# EAGLE design B198X (EAGLE 6.6.0)
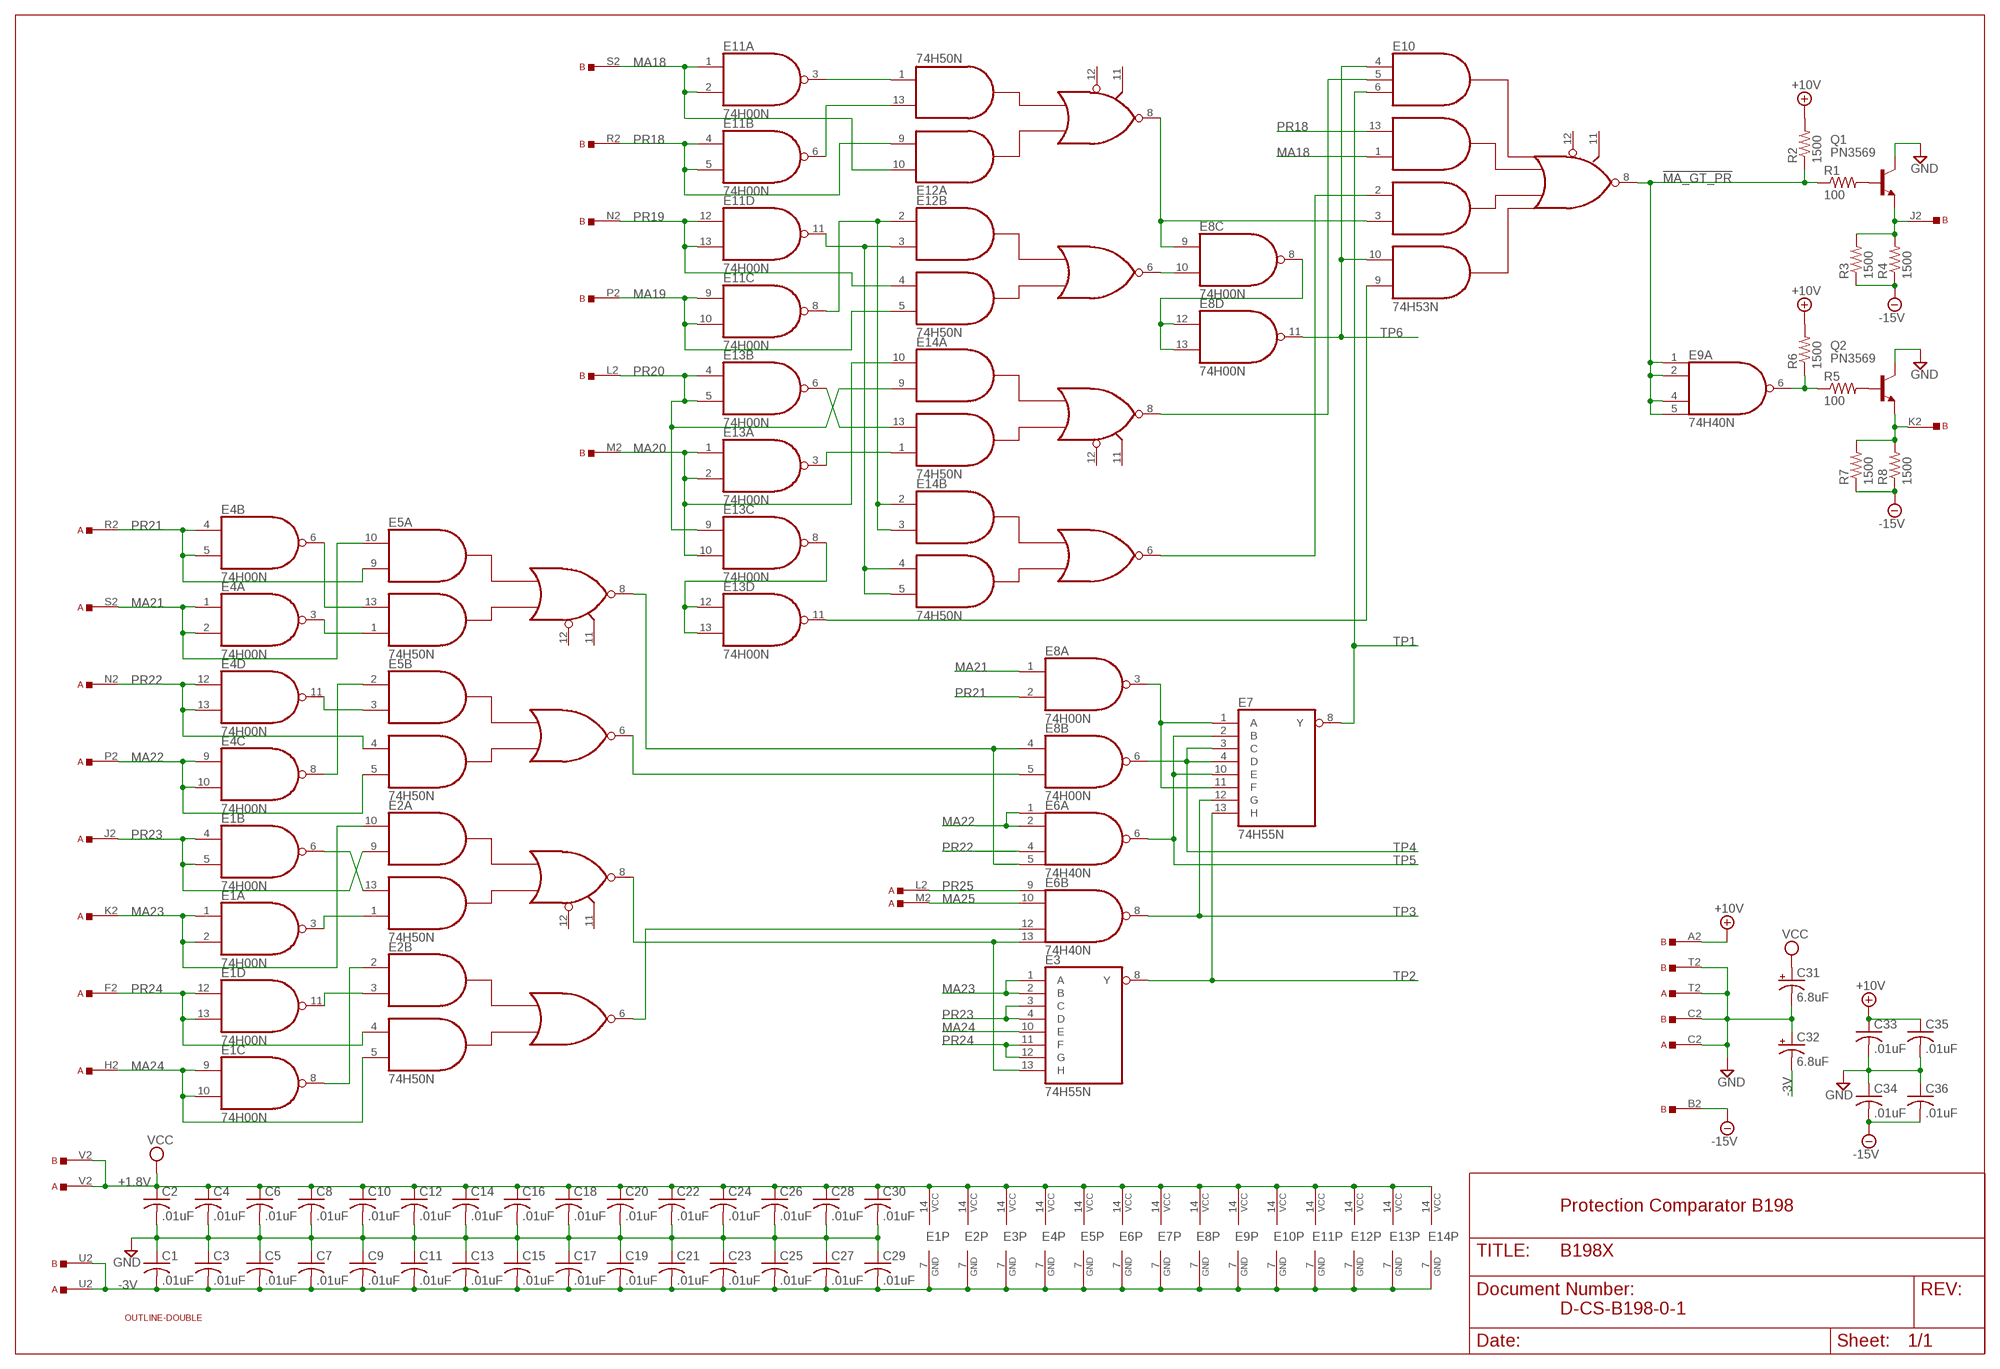
[diagram p0: schematic, sheet 1]

## Parts
A  SS-TOP  [EDGE-CON1]
B  SS-TOP  [EDGE-CON1]
C1  .01uF  C-US  [C063-025X075]
C2  .01uF  C-US  [C063-025X075]
C3  .01uF  C-US  [C063-025X075]
C4  .01uF  C-US  [C063-025X075]
C5  .01uF  C-US  [C063-025X075]
C6  .01uF  C-US  [C063-025X075]
C7  .01uF  C-US  [C063-025X075]
C8  .01uF  C-US  [C063-025X075]
C9  .01uF  C-US  [C063-025X075]
C10  .01uF  C-US  [C063-025X075]
C11  .01uF  C-US  [C063-025X075]
C12  .01uF  C-US  [C063-025X075]
C13  .01uF  C-US  [C063-025X075]
C14  .01uF  C-US  [C063-025X075]
C15  .01uF  C-US  [C063-025X075]
C16  .01uF  C-US  [C063-025X075]
C17  .01uF  C-US  [C063-025X075]
C18  .01uF  C-US  [C063-025X075]
C19  .01uF  C-US  [C063-025X075]
C20  .01uF  C-US  [C063-025X075]
C21  .01uF  C-US  [C063-025X075]
C22  .01uF  C-US  [C063-025X075]
C23  .01uF  C-US  [C063-025X075]
C24  .01uF  C-US  [C063-025X075]
C25  .01uF  C-US  [C063-025X075]
C26  .01uF  C-US  [C063-025X075]
C27  .01uF  C-US  [C063-025X075]
C28  .01uF  C-US  [C063-025X075]
C29  .01uF  C-US  [C063-025X075]
C30  .01uF  C-US  [C063-025X075]
C31  6.8uF  CPOL-USE15-5AXIAL  [E15-5]
C32  6.8uF  CPOL-USE15-5AXIAL  [E15-5]
C33  .01uF  C-US  [C063-025X075]
C34  .01uF  C-US  [C063-025X075]
C35  .01uF  C-US  [C063-025X075]
C36  .01uF  C-US  [C063-025X075]
E1  74H00N  74S00N  [DIL14]
E2  74H50N  7450N  [DIL14]
E3  74H55N  74LS55N  [DIL14]
E4  74H00N  74S00N  [DIL14]
E5  74H50N  7450N  [DIL14]
E6  74H40N  7440N  [DIL14]
E7  74H55N  74LS55N  [DIL14]
E8  74H00N  74S00N  [DIL14]
E9  74H40N  7440N  [DIL14]
E10  74H53N  [DIL14]
E11  74H00N  74S00N  [DIL14]
E12  74H50N  7450N  [DIL14]
E13  74H00N  74S00N  [DIL14]
E14  74H50N  7450N  [DIL14]
Q1  PN3569  -NPN-TO5  [TO5]
Q2  PN3569  -NPN-TO5  [TO5]
R1  100  R-US_0207/10  [0207/10]
R2  1500  R-US_0207/10  [0207/10]
R3  1500  R-US_0207/10  [0207/10]
R4  1500  R-US_0207/10  [0207/10]
R5  100  R-US_0207/10  [0207/10]
R6  1500  R-US_0207/10  [0207/10]
R7  1500  R-US_0207/10  [0207/10]
R8  1500  R-US_0207/10  [0207/10]
U$1  OUTLINE-DOUBLE  [DOUBLE]

## Nets
!MA_GT_PR: E9.1(A:I0) E9.2(A:I1) E9.4(A:I2) E9.5(A:I3) E10.8(O) R1.1 R2.1
+10V: B.A2 C33.1 C35.1 R2.2 R6.2
-3V: A.U2 B.U2 C1.2 C3.2 C5.2 C7.2 C9.2 C11.2 C13.2 C15.2 C17.2 C19.2 C21.2 C23.2 C25.2 C27.2 C29.2 C32.- E1.7(P:GND) E2.7(P:GND) E3.7(GND) E4.7(P:GND) E5.7(P:GND) E6.7(P:GND) E7.7(GND) E8.7(P:GND) E9.7(P:GND) E10.7(GND) E11.7(P:GND) E12.7(P:GND) E13.7(P:GND) E14.7(P:GND)
-15V: B.B2 C34.2 C36.2 R3.1 R4.1 R7.1 R8.1
GND: A.C2 A.T2 B.C2 B.T2 C1.1 C2.2 C3.1 C4.2 C5.1 C6.2 C7.1 C8.2 C9.1 C10.2 C11.1 C12.2 C13.1 C14.2 C15.1 C16.2 C17.1 C18.2 C19.1 C20.2 C21.1 C22.2 C23.1 C24.2 C25.1 C26.2 C27.1 C28.2 C29.1 C30.2 C31.- C32.+ C33.2 C34.1 C35.2 C36.1 Q1.3(C) Q2.3(C)
MA18: B.S2 E10.1(I4) E11.1(A:I0) E11.2(A:I1) E12.10(A:I1)
MA19: B.P2 E11.9(C:I0) E11.10(C:I1) E12.5(B:I4)
MA20: B.M2 E13.1(A:I0) E13.2(A:I1) E13.10(C:I1) E14.10(A:I1)
MA21: A.S2 E4.1(A:I0) E4.2(A:I1) E5.10(A:I1) E8.1(A:I0)
MA22: A.P2 E4.9(C:I0) E4.10(C:I1) E5.5(B:I4) E6.1(A:I0) E6.2(A:I1)
MA23: A.K2 E1.1(A:I0) E1.2(A:I1) E2.10(A:I1) E3.1(A) E3.2(B)
MA24: A.H2 E1.9(C:I0) E1.10(C:I1) E2.5(B:I4) E3.10(E)
MA25: A.M2 E6.10(B:I1)
N$1: Q1.2(B) R1.2
N$2: Q2.2(B) R5.2
N$3: B.J2 Q1.1(E) R3.2 R4.2
N$4: E8.8(C:O) E8.12(D:I0) E8.13(D:I1)
N$5: E5.6(B:O) E8.5(B:I1)
N$6: B.K2 Q2.1(E) R7.2 R8.2
N$7: E9.6(A:O) R5.1 R6.1
N$8: E8.9(C:I0) E10.3(I6) E12.8(A:O)
N$9: E11.11(D:O) E12.3(B:I2) E14.4(B:I3) E14.5(B:I4)
N$10: E11.8(C:O) E12.2(B:I1) E14.2(B:I1) E14.3(B:I2)
N$11: E10.5(I11) E14.8(A:O)
N$12: E10.2(I5) E14.6(B:O)
N$13: E8.10(C:I1) E12.6(B:O)
N$14: E11.6(B:O) E12.13(A:I3)
N$15: E11.3(A:O) E12.1(A:I4)
N$16: E13.3(A:O) E14.1(A:I4)
N$17: E13.6(B:O) E14.13(A:I3)
N$18: E4.11(D:O) E5.3(B:I2)
N$19: E10.9(I8) E13.11(D:O)
N$20: E7.1(A) E7.11(F) E8.3(A:O)
N$21: E13.8(C:O) E13.12(D:I0) E13.13(D:I1)
N$22: E4.8(C:O) E5.2(B:I1)
N$23: E1.3(A:O) E2.1(A:I4)
N$24: E2.8(A:O) E3.13(H) E6.13(B:I3)
N$25: E2.6(B:O) E6.12(B:I2)
N$26: E1.6(B:O) E2.13(A:I3)
N$27: E1.11(D:O) E2.3(B:I2)
N$28: E1.8(C:O) E2.2(B:I1)
N$30: E5.8(A:O) E6.5(A:I3) E8.4(B:I0)
N$38: E4.3(A:O) E5.1(A:I4)
N$39: E4.6(B:O) E5.13(A:I3)
PR18: B.R2 E10.13(I3) E11.4(B:I0) E11.5(B:I1) E12.9(A:I2)
PR19: B.N2 E11.12(D:I0) E11.13(D:I1) E12.4(B:I3)
PR20: B.L2 E13.4(B:I0) E13.5(B:I1) E13.9(C:I0) E14.9(A:I2)
PR21: A.R2 E4.4(B:I0) E4.5(B:I1) E5.9(A:I2) E8.2(A:I1)
PR22: A.N2 E4.12(D:I0) E4.13(D:I1) E5.4(B:I3) E6.4(A:I2)
PR23: A.J2 E1.4(B:I0) E1.5(B:I1) E2.9(A:I2) E3.3(C) E3.4(D)
PR24: A.F2 E1.12(D:I0) E1.13(D:I1) E2.4(B:I3) E3.11(F) E3.12(G)
PR25: A.L2 E6.9(B:I0)
TP1: E7.8(Y) E10.6(I2)
TP2: E3.8(Y) E7.13(H)
TP3: E6.8(B:O) E7.12(G)
TP4: E7.3(C) E7.4(D) E8.6(B:O)
TP5: E6.6(A:O) E7.2(B) E7.10(E)
TP6: E8.11(D:O) E10.4(I1) E10.10(I7)
VCC: A.V2 B.V2 C2.1 C4.1 C6.1 C8.1 C10.1 C12.1 C14.1 C16.1 C18.1 C20.1 C22.1 C24.1 C26.1 C28.1 C30.1 C31.+ E1.14(P:VCC) E2.14(P:VCC) E3.14(VCC) E4.14(P:VCC) E5.14(P:VCC) E6.14(P:VCC) E7.14(VCC) E8.14(P:VCC) E9.14(P:VCC) E10.14(VCC) E11.14(P:VCC) E12.14(P:VCC) E13.14(P:VCC) E14.14(P:VCC)
Unconnected: A.A2 A.B2 A.D2 A.E2 B.D2 B.E2 B.F2 B.H2 E2.11(A:I6) E2.12(A:I5) E5.11(A:I6) E5.12(A:I5) E6.3(3:NC) E6.11(11:NC) E9.3(3:NC) E9.8(B:O) E9.9(B:I0) E9.10(B:I1) E9.11(11:NC) E9.12(B:I2) E9.13(B:I3) E10.11(I10) E10.12(I9) E12.11(A:I6) E12.12(A:I5) E14.11(A:I6) E14.12(A:I5)

## Notes on the sheet
- +1.8V
- Protection Comparator B198
- D-CS-B198-0-1

## Library data of the parts
A B = dec-con:SS-TOP: Single Sided Top Connector. Also suitable for building wider single-sided modules.
C1-C30 C33-C36 = dec-con:C-US: Capacitors with funky DEC lead spacing.
C31 C32 = dec-con:CPOL-USE15-5AXIAL: 0.6" version of an electrolytic
E1 E4 E8 E11 E13 = 74xx-us:74*00: Quad 2-input NAND gate
E2 E5 E12 E14 = dec-con:74*50: 4-2-3-2 input AND OR INVERTER gates
E3 E7 = 74xx-us:74*55: 2-wide 4-input AND OR INVERTER gate
E6 E9 = dec-con:74*40: Dual 4-input NAND gate
E10 = dec-con:74H53N: 2-2-2-3 Input And-Or-Invert Gate
Q1 Q2 = transistor:*-NPN-: NPN Transistror BF959 corrected 2008.03.06
R1-R8 = rcl:R-US_: RESISTOR, American symbol
U$1 = dec-con:OUTLINE-*: Board outlines for DEC boards.

## Board
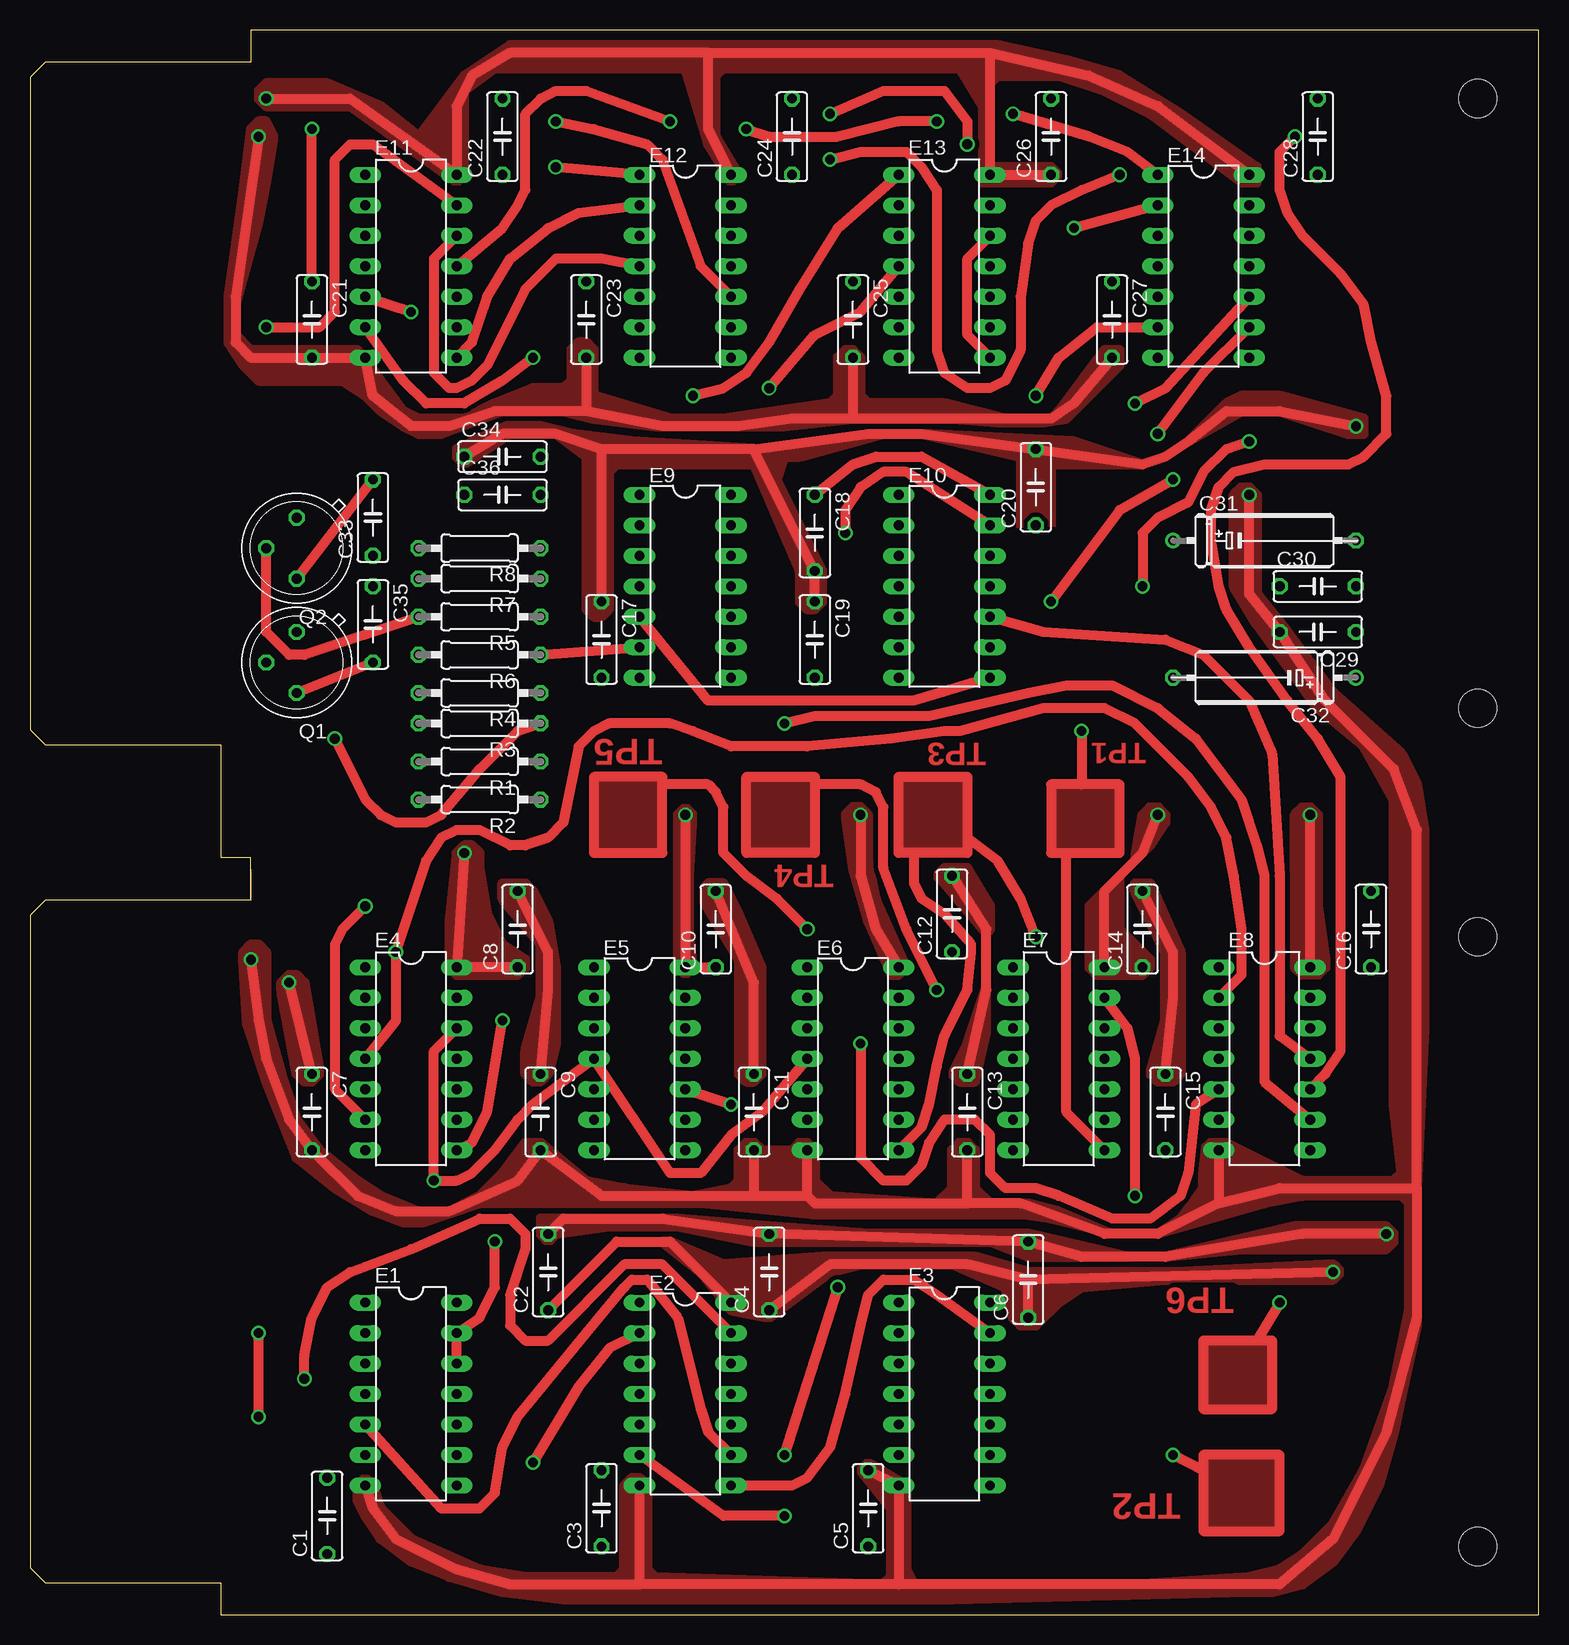
[diagram p1: board, top side]
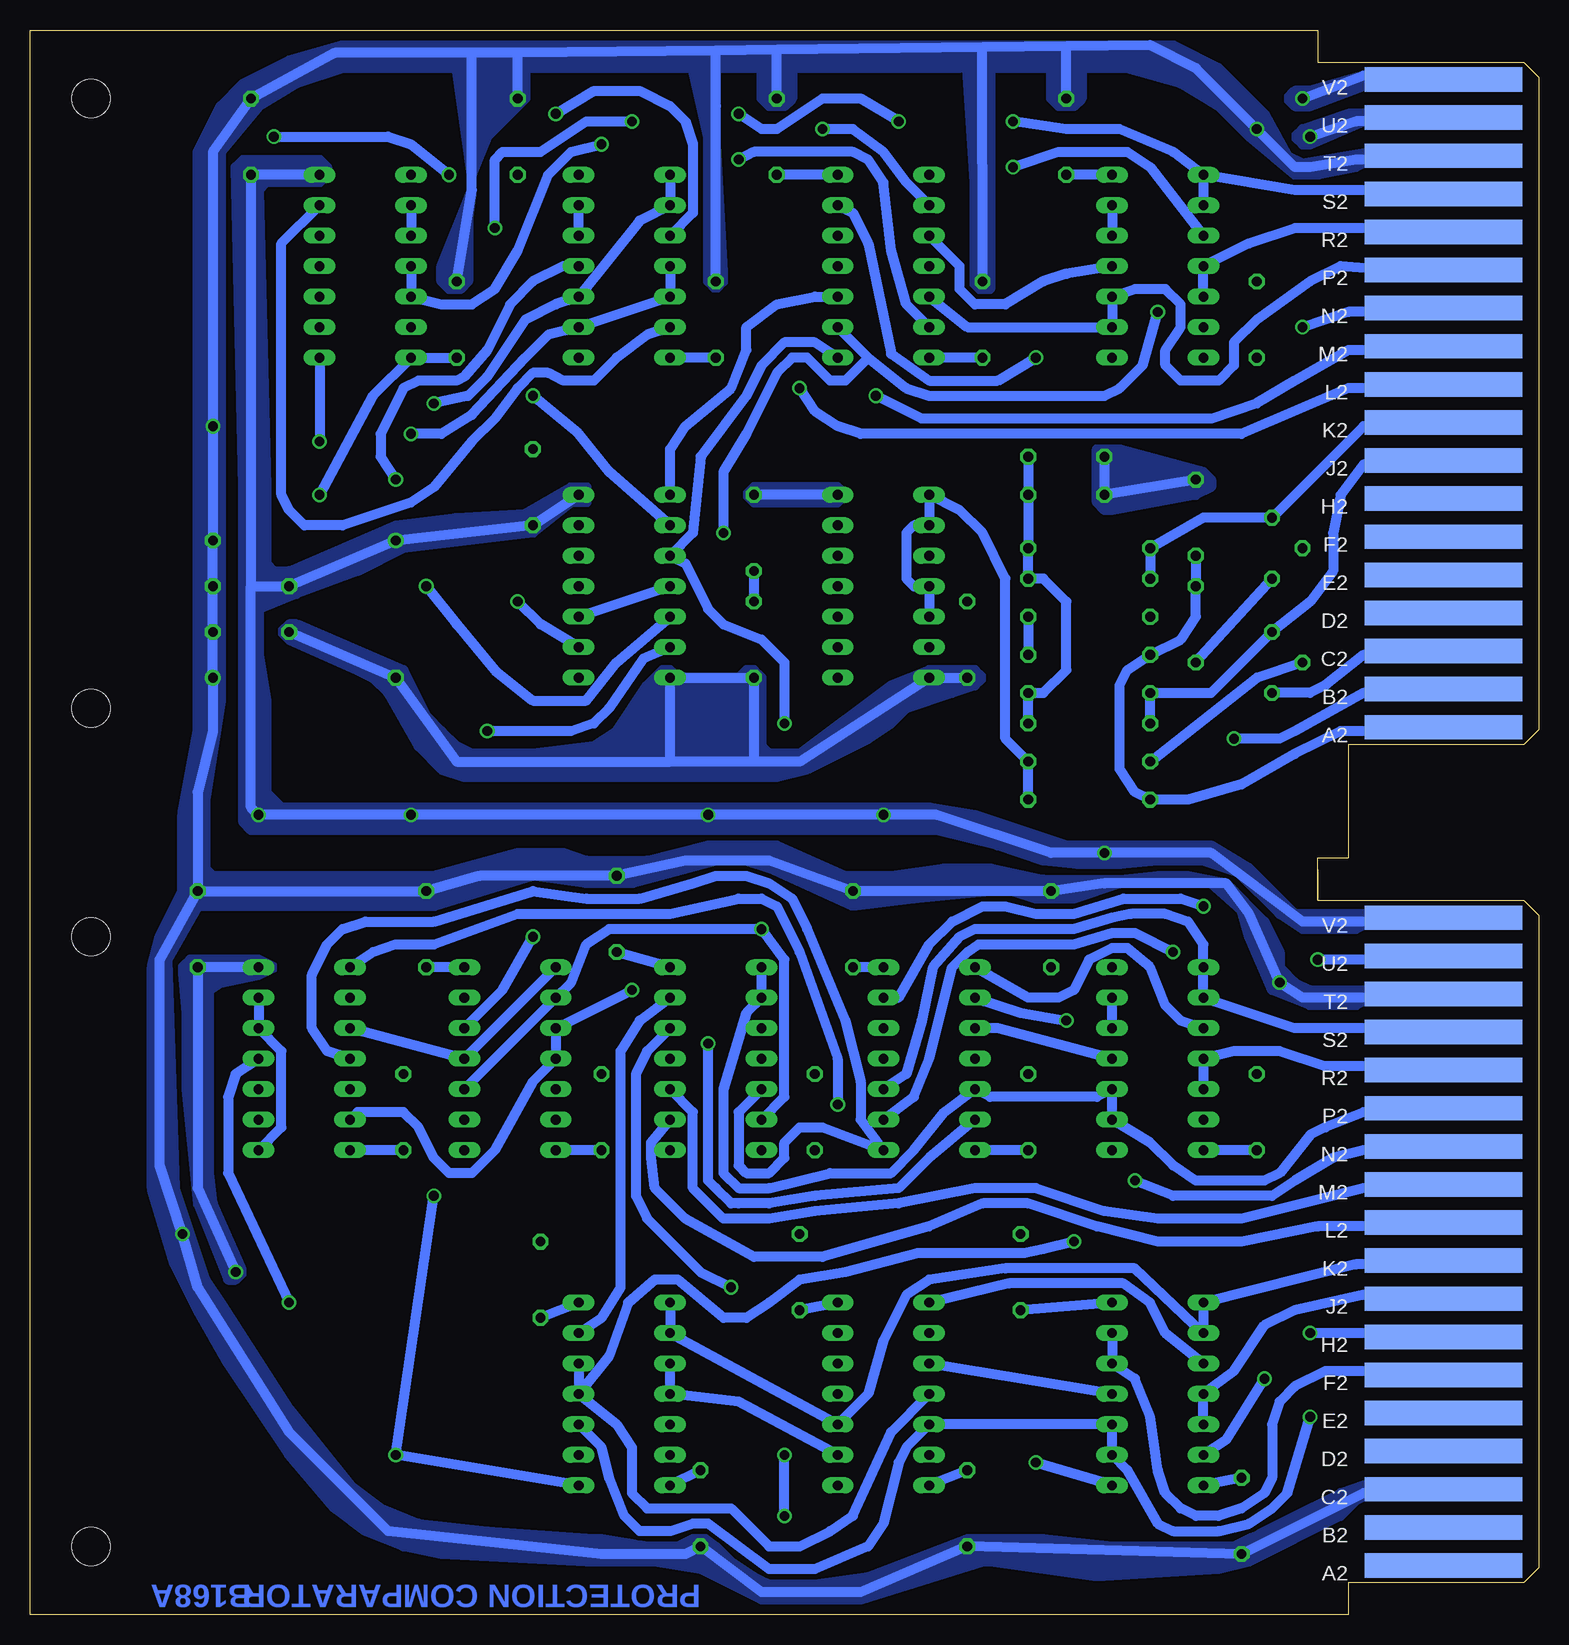
[diagram p2: board, bottom side, seen from below]

Size 125.73 x 132.08 mm. Coordinates in mm from the lower left corner, seen from the top.
Copper layers (1+16): Top 0.035mm / dielectric 1.5mm / Bottom 0.035mm
Design rules "16mils *": minimum track width 16mil, minimum drill 32mil, track to track 15mil, track to pad 10mil, pad to pad 10mil, via to via 10mil, smd to smd 10mil, copper to edge 13mil, drill to drill 10mil, minimum pad ring 10mil, minimum via ring 8mil, stop-mask expansion 0mil, vias tented up to drill 0mil, thermal gap 10mil

### Footprints (pad centres in the part's own frame; a part is rotated, then mirrored left to right if it is on the bottom)
EDGE-CON1 = smd 13.106 x 2.032 bottom: A2 7.938,4.128; B2 7.938,7.303; C2 7.938,10.477; D2 7.938,13.652; E2 7.938,16.828; F2 7.938,20.003; H2 7.938,23.177; J2 7.938,26.352; K2 7.938,29.527; L2 7.938,32.703; M2 7.938,35.877; N2 7.938,39.053; P2 7.938,42.227; R2 7.938,45.403; S2 7.938,48.578; T2 7.938,51.752; U2 7.938,54.928; V2 7.938,58.102
C063-025X075 = drill 0.813 octagon: 1 -2.54,0; 2 3.81,0
E15-5 = drill 0.813: + -7.62,0 | drill 0.813 octagon: - 7.62,0
DIL14 = drill 0.813 long: 1 -7.62,-3.81; 2 -5.08,-3.81; 3 -2.54,-3.81; 4 0,-3.81; 5 2.54,-3.81; 6 5.08,-3.81; 7 7.62,-3.81; 8 7.62,3.81; 9 5.08,3.81; 10 2.54,3.81; 11 0,3.81; 12 -2.54,3.81; 13 -5.08,3.81; 14 -7.62,3.81
TO5 = drill 0.813 octagon: 1 0,-2.54; 2 2.54,0; 3 0,2.54
0207/10 = drill 0.813 octagon: 1 -5.08,0; 2 5.08,0
DOUBLE = hole 3.175: 120.65,56.515; 120.65,5.715; 120.65,75.565; 120.65,126.365

### Placement (x,y rotation side)
A  0,0 0 top
B  0,69.85 0 top
C1  24.77,7.62 90 top
C2  43.18,27.94 90 top
C3  47.63,8.26 90 top
C4  61.6,27.94 90 top
C5  69.85,8.26 90 top
C6  83.19,27.3 90 top
C7  23.5,42.55 270 top
C8  40.64,56.52 90 top
C9  42.55,42.55 270 top
C10  57.15,56.52 90 top
C11  60.33,42.55 270 top
C12  76.84,57.78 90 top
C13  78.11,42.55 270 top
C14  92.71,56.52 90 top
C15  94.62,42.55 270 top
C16  111.76,56.52 90 top
C17  47.63,81.92 270 top
C18  65.41,90.81 270 top
C19  65.41,81.92 270 top
C20  83.82,93.34 90 top
C21  23.5,108.58 270 top
C22  39.37,122.56 90 top
C23  46.36,108.58 270 top
C24  63.5,122.56 90 top
C25  68.58,108.58 270 top
C26  85.09,122.56 90 top
C27  90.17,108.58 270 top
C28  107.32,122.56 90 top
C29  107.95,81.92 180 top
C30  106.68,85.72 0 top
C31  102.87,89.53 0 top
C32  102.87,78.11 180 top
C33  28.58,90.81 90 top
C34  38.74,96.52 0 top
C35  28.58,83.19 270 top
C36  38.74,93.34 0 top
E1  31.75,18.41 270 top
E2  54.61,18.41 270 top
E3  76.2,18.41 270 top
E4  31.75,46.35 270 top
E5  50.8,46.35 270 top
E6  68.58,46.35 270 top
E7  85.73,46.35 270 top
E8  102.87,46.35 270 top
E9  54.61,85.72 270 top
E10  76.2,85.72 270 top
E11  31.75,112.39 270 top
E12  54.61,112.39 270 top
E13  76.2,112.39 270 top
E14  97.79,112.39 270 top
Q1  22.23,79.38 180 top
Q2  22.23,88.9 180 top
R1  37.47,71.12 180 top
R2  37.47,67.94 180 top
R3  37.47,74.3 180 top
R4  37.47,76.83 180 top
R5  37.47,83.19 180 top
R6  37.47,80.01 180 top
R7  37.47,86.36 180 top
R8  37.47,88.9 180 top
U$1  0,0 0 top

### Tracks (layer width: path | path; a pad name or v marks a point on that pad's centre or on a via)
!MA_GT_PR
  Top 0.813: E10.8 73.66,76.2 56.52,76.2 E9.5
  Bottom 0.813: E9.5 E9.4 52.07,85.72 52.71,86.36 52.71,90.17 52.07,90.81 E9.2 E9.1 48.26,92.08 46.36,90.17 44.45,86.36 44.45,73.03 R1.1 R2.1
+10V
  Bottom 0.813: B.A2 9.53,73.66 16.51,73.66 20.32,71.75 24.77,69.22 29.21,67.94 R2.2 33.66,68.58 34.93,70.48 34.93,77.47 34.29,78.74 R6.2 29.85,81.28 28.58,83.19 C35.1 C33.1
-3V  (via drill 0.81)
  Top 0.813: v18.42,54.61 19.05,49.53 19.69,46.35 21.59,41.27 C7.2 27.31,34.92 30.48,33.66 34.93,33.66 40.64,36.2 C9.2 47.63,34.92 60.33,34.92 | C11.2 60.33,34.92 | 60.33,34.92 64.77,34.92 | 64.77,34.92 E6.7 | 64.77,34.92 65.41,34.29 78.11,34.29 | 78.11,34.29 C13.2 | E8.7 99.06,34.29 | 99.06,34.29 93.98,31.75 89.54,31.75 82.55,34.29 78.11,34.29 | 99.06,34.29 104.14,35.56 115.57,35.56 | 115.57,35.56 115.57,24.77 113.03,15.24 108.59,6.35 104.14,2.54 72.39,2.54 | 72.39,2.54 50.8,2.54 | 50.8,2.54 E2.7 | C5.2 E3.7 72.39,2.54 | E1.7 28.58,8.89 30.48,6.35 35.56,3.81 40.01,2.54 50.8,2.54 | v101.6,93.34 101.6,85.09 C29.2 107.95,76.2 113.67,70.48 115.57,65.41 115.57,35.56 | v19.05,123.19 17.15,109.86 17.15,106.05 18.42,104.78 C21.2 E11.7 28.58,101.6 31.75,99.06 34.93,99.06 38.74,100.33 46.36,100.33 | C23.2 46.36,100.33 | C25.2 68.58,99.69 | 68.58,99.69 63.5,99.69 59.06,99.06 52.71,99.06 46.36,100.33 | C27.2 87,100.97 85.09,99.69 68.58,99.69
  Bottom 0.813: C5.2 E3.7 | C29.2 C32.- 90.17,71.12 72.39,71.12 | C7.2 E4.7 | C3.2 E2.7 | C1.2 E1.7 | C9.2 E5.7 | C15.2 E8.7 | 72.39,71.12 E10.7 C19.2 65.41,71.12 | 65.41,71.12 72.39,71.12 | C17.2 E9.7 61.6,71.12 65.41,71.12 | v101.6,93.34 97.16,101.6 E14.7 C27.2 | B.U2 8.89,124.46 15.24,124.46 v19.05,123.19 | C25.2 E13.7 | C23.2 E12.7 | C13.2 E7.7 | A.U2 9.53,54.61 v18.42,54.61
  pour Top (no thermals): 19.05,124.46 18.42,123.83 17.78,118.75 16.51,109.86 16.51,106.05 17.78,104.14 19.05,102.87 26.04,102.87 27.94,101.6 29.21,100.33 31.12,99.06 32.39,98.42 34.29,98.42 39.37,100.33 44.45,100.33 46.99,99.69 52.07,99.06 62.87,99.06 68.58,99.69 76.84,99.69 80.65,99.38 84.46,99.38 86.36,99.69 90.81,104.14 90.81,105.41 89.54,105.41 85.73,100.33 85.09,99.69 81.28,99.69 76.2,100.97 69.85,100.97 69.22,101.6 69.22,104.78 68.58,105.41 67.95,105.41 67.31,104.78 67.31,101.6 66.68,100.97 57.79,99.69 53.34,99.69 46.99,101.6 46.99,105.41 46.36,106.05 45.72,106.05 45.09,105.41 45.09,102.87 44.45,102.23 41.91,102.23 38.74,100.97 36.2,99.69 32.39,99.69 31.12,100.33 29.21,102.87 27.94,104.78 27.31,105.41 18.42,105.41 17.15,106.68 17.15,109.22 19.05,116.2 19.69,119.38 20.32,123.19 19.69,124.46
  pour Top (no thermals): 27.31,9.53 27.31,10.79 27.94,11.43 28.58,10.79 29.21,8.89 31.75,6.35 37.47,3.81 41.28,3.17 48.9,3.17 49.53,3.81 49.53,10.79 50.17,11.43 50.8,11.43 51.44,10.79 51.44,3.81 52.07,3.17 71.12,2.54 71.76,3.17 71.76,8.89 69.22,12.06 69.85,12.7 73.03,10.79 73.03,3.81 73.66,2.54 92.08,2.54 101.6,3.17 104.14,3.81 106.05,5.08 108.59,7.62 111.13,12.06 113.67,19.05 114.94,25.4 114.94,34.29 114.3,34.92 106.05,34.92 102.87,34.29 93.98,31.75 95.89,33.02 97.79,35.56 97.79,38.73 98.43,39.37 99.7,39.37 106.05,36.2 113.67,36.2 114.3,36.83 113.67,42.55 113.67,67.94 111.13,72.39 107.32,75.56 102.24,82.55 100.33,85.72 100.33,93.34 100.97,93.98 101.6,93.98 102.24,93.34 102.24,85.09 104.78,81.92 108.59,76.83 114.3,71.75 115.57,69.22 116.21,65.41 116.21,48.9 115.57,35.56 115.57,24.13 114.3,18.41 113.67,15.24 112.4,10.79 110.49,6.99 108.59,4.45 106.05,2.54 103.51,1.91 101.6,1.91 76.84,1.27 44.45,1.27 39.37,1.91 34.93,3.17 31.75,4.45 29.21,6.35 27.94,8.26
  pour Top (no thermals): 17.78,54.61 17.78,55.24 18.42,55.88 19.05,55.88 19.69,55.24 19.69,49.53 20.96,45.09 22.23,41.27 24.13,38.73 27.31,36.2 29.21,34.92 32.39,33.66 34.93,33.66 37.47,34.92 39.37,36.83 41.28,39.37 42.55,39.37 46.36,36.2 49.53,35.56 55.25,34.92 58.42,35.56 59.06,36.2 59.06,38.73 59.69,39.37 60.33,39.37 60.96,38.73 63.5,38.73 64.14,39.37 64.77,39.37 65.41,38.73 65.41,36.2 66.68,34.92 75.57,34.29 76.84,35.56 76.84,38.73 77.47,39.37 78.11,39.37 78.74,38.73 78.74,35.56 80.01,34.29 83.19,34.29 85.73,33.66 90.17,31.75 85.09,33.02 82.87,33.34 65.41,33.34 55.88,34.29 37.47,34.29 32.7,32.7 31.12,32.7 28.58,33.66 25.4,35.56 22.23,38.1 19.69,44.45 18.1,49.21
  pour Bottom (no thermals): 46.99,78.74 50.8,78.74 53.98,77.47 61.6,71.75 64.14,71.75 64.77,72.39 64.77,78.11 65.41,78.74 66.04,78.74 66.68,78.11 71.76,78.11 72.39,78.74 73.03,78.74 74.3,77.47 76.84,73.66 78.74,72.39 83.82,71.75 88.9,71.75 90.17,72.39 91.44,73.66 92.71,74.93 94.62,78.74 103.51,82.55 104.14,82.55 104.78,81.92 104.14,81.28 98.43,78.74 97.16,78.11 95.89,76.83 93.35,72.39 91.44,70.48 89.54,69.85 84.46,69.85 69.85,69.85 63.5,69.85 60.96,70.48 55.88,73.03 53.98,74.3 52.71,75.56 48.9,76.83 46.99,77.47 46.36,78.11
  pour Bottom (no thermals): 13.97,124.46 13.97,125.09 15.88,125.09 19.69,123.83 20.32,123.19 19.69,122.56 19.05,122.56 14.61,124.46
-15V  (via drill 0.81)
  Top 0.813: v25.4,73.03 27.94,67.94 29.21,66.67 30.48,66.04 33.02,66.04 34.29,66.67 37.47,70.48 40.64,73.66 R3.1
  Bottom 0.813: R3.1 R4.1 41.28,76.83 39.37,78.74 39.37,84.45 41.28,86.36 R7.1 R8.1 C36.2 C34.2 | B.B2 8.89,76.83 14.61,76.83 20.32,73.66 21.59,73.03 v25.4,73.03
GND  (via drill 0.81)
  Top 0.813: C7.1 v21.59,52.7 | C2.2 44.45,33.02 52.71,33.02 C4.2 C6.2 87.63,29.84 94.62,29.84 106.05,31.75 v113.03,31.75 | Q1.3 C35.2 | Q2.3 C33.2 | C17.1 47.63,97.16 | 47.63,97.16 43.82,98.42 39.37,98.42 C34.1 | C19.1 C18.2 60.33,97.16 | 60.33,97.16 47.63,97.16 | 60.33,97.16 69.85,98.42 74.3,98.42 C20.2 92.71,95.89 94.62,96.52 96.52,97.79 99.7,100.33 104.14,100.33 v110.49,99.06 | C9.1 43.18,52.07 43.18,55.24 C8.2 | C11.1 60.33,52.7 C10.2 | C13.1 79.69,52.07 79.69,57.15 C12.2 | C21.1 v23.5,123.83 | C15.1 95.25,51.44 95.25,55.24 C14.2
  Bottom 0.813: A.C2 8.89,10.48 8.89,10.16 14.61,10.16 C1.1 C3.1 56.52,1.91 64.77,1.91 C5.1 71.12,5.08 78.11,5.08 95.89,6.99 104.14,15.24 111.76,27.3 v113.03,31.75 114.94,37.47 114.94,54.61 C16.2 | C16.2 C14.2 88.27,61.59 C12.2 71.12,62.87 64.14,62.87 C10.2 C8.2 36.2,60.96 26.04,60.96 24.13,58.42 v21.59,52.7 19.69,51.44 8.89,51.44 A.T2 | B.C2 8.89,80.01 14.61,80.01 17.78,77.47 19.05,76.83 Q1.3 | Q2.3 C35.2 | C33.2 C36.1 C34.1 | C18.2 C19.1 | C26.2 85.09,130.18 | 85.09,130.18 88.9,130.18 | 88.9,130.18 100.33,130.18 C28.2 110.49,121.92 v110.49,99.06 C31.- C30.2 C29.1 C32.+ 110.49,73.66 111.76,68.58 C16.2 | B.T2 8.26,121.28 15.24,121.28 19.05,120.65 20.32,120.65 v23.5,123.83 28.58,128.91 32.39,130.81 39.38,130.72 | 39.38,130.72 46.36,130.64 | 46.36,130.64 63.5,130.43 | 63.5,130.43 68.58,130.37 | 68.58,130.37 85.09,130.18 | C22.2 39.38,130.72 | C24.2 63.5,130.43 | C25.1 68.58,125.73 68.58,130.37 | C23.1 46.36,130.64 | C27.1 88.9,118.75 88.9,130.18
  pour Top (no thermals): 46.36,96.52 46.36,83.82 46.99,83.19 47.63,83.19 48.26,83.82 48.26,95.25 48.9,95.89 60.33,95.89 64.14,87 64.14,84.45 64.77,83.82 65.41,83.82 66.04,84.45 66.04,87 62.23,94.61 62.87,96.52 64.14,96.52 71.12,98.42 60.96,97.16 50.17,97.79 45.09,98.42 42.55,99.06 39.69,99.06 35.56,97.16 35.56,96.52 36.2,95.89 40.01,98.42 43.82,98.42
  pour Top (no thermals): 74.3,98.42 82.55,96.52 82.55,90.81 83.19,90.17 84.46,90.17 85.09,90.81 85.09,95.89 92.71,95.89 87,97.79
  pour Top (no thermals): 96.52,97.79 100.97,100.33 104.14,100.33 109.86,98.42 111.13,98.42 111.13,99.69 104.14,101.6 100.97,101.6 99.7,100.97
  pour Top (no thermals): 21.59,53.34 22.23,53.34 22.86,52.7 24.13,45.09 23.5,44.45 22.86,44.45 22.23,45.09 20.96,52.07 20.96,52.7
  pour Top (no thermals): 42.55,33.02 42.55,31.75 43.18,31.11 43.82,31.75 48.26,32.38 53.98,32.38 60.33,31.11 62.87,31.11 80.01,31.11 83.19,29.84 88.27,29.84 91.44,29.84 83.19,31.75 69.85,31.75 61.6,32.38 53.98,33.02
  pour Top (no thermals): 94.62,29.84 100.97,30.48 109.86,30.48 113.03,30.48 113.67,31.11 113.67,31.75 113.03,32.38 105.41,32.38
  pour Top (no thermals): 93.35,60.96 95.89,55.24 95.89,45.09 95.25,44.45 94.62,44.45 93.98,44.45 93.35,45.09 94.62,49.53 94.62,55.24 92.08,60.33 92.08,60.96
  pour Top (no thermals): 80.01,57.15 80.01,59.05 78.11,62.23 76.2,62.23 75.57,61.59 76.2,60.96 79.38,57.15 79.69,56.83
  pour Top (no thermals): 77.47,44.45 78.74,44.45 79.69,48.58 79.69,52.39 78.11,47.62 76.84,45.09
  pour Top (no thermals): 59.06,54.61 59.06,45.09 59.69,44.45 60.33,44.45 60.96,45.09 60.96,53.98 59.06,58.42 57.79,60.96 56.52,60.96 56.2,60.64 56.2,59.37
  pour Top (no thermals): 40.01,60.96 41.28,60.96 41.91,60.33 43.18,57.78 43.82,53.98 43.82,47.62 43.18,45.09 42.55,44.45 41.91,44.45 41.28,45.09 41.28,46.99 42.55,51.44 42.55,55.88 39.37,59.69 39.37,60.96
  pour Bottom (no thermals): 13.97,10.79 13.97,10.16 15.24,9.53 16.51,8.26 24.13,4.45 26.67,3.81 36.83,3.17 45.72,4.45 46.36,4.45 56.52,1.27 64.77,1.27 69.85,3.81 73.66,4.45 79.38,4.45 91.44,5.08 94.62,5.71 97.79,6.99 100.33,8.89 104.14,13.34 109.22,20.95 111.76,25.4 113.67,29.21 115.57,35.56 115.57,53.98 114.94,56.52 113.03,60.33 113.03,66.67 111.76,73.66 111.76,121.92 109.86,125.73 107.95,127.64 104.14,129.54 99.7,130.81 30.48,130.81 26.67,128.91 22.86,125.09 20.96,121.6 19.69,120.97 13.97,121.92 13.97,121.28 15.24,120.65 18.42,120.02 20.32,120.02 24.13,123.19 26.67,125.73 29.85,127.64 34.29,128.91 38.1,128.91 38.1,126.36 38.74,125.73 40.01,125.73 40.64,126.36 40.64,128.91 45.72,128.91 45.72,110.49 46.99,110.49 46.99,119.38 47.63,128.91 48.26,129.54 48.26,128.91 62.23,128.91 62.23,126.36 62.87,125.73 64.14,125.73 64.77,126.36 64.77,128.91 68.58,128.91 68.58,122.56 67.95,111.12 68.58,110.49 69.22,111.12 69.22,123.19 70.49,128.91 84.46,128.91 84.46,126.36 87.63,123.19 88.9,120.02 90.17,128.91 99.7,128.91 103.51,127.64 106.68,125.73 109.86,121.92 109.86,76.2 111.13,67.94 111.13,62.23 110.49,61.59 92.08,61.59 85.09,63.5 81.28,63.5 79.38,62.87 74.3,62.87 69.22,64.14 63.5,64.14 57.79,61.59 53.98,61.59 49.53,62.23 45.72,62.23 41.28,61.28 34.93,61.28 31.75,61.59 29.21,61.59 26.04,60.96 22.86,57.78 21.59,55.24 21.59,53.98 20.32,52.7 19.05,52.07 13.97,52.07 13.97,51.44 15.24,50.8 19.05,50.8 22.23,52.07 24.13,56.52 24.77,58.74 27.31,60.96 34.93,60.96 38.74,59.69 41.91,59.69 43.82,60.33 45.72,60.33 52.07,59.69 57.15,59.05 64.14,62.23 66.04,62.87 68.58,62.87 75.57,60.96 79.38,60.96 83.82,61.59 92.08,59.05 111.76,59.05 114.3,54.61 113.67,35.56 111.13,27.94 109.86,26.04 104.14,17.14 99.06,10.79 96.52,8.89 93.35,7.62 87.63,6.99 78.74,6.35 78.11,6.35 74.3,5.71 71.76,5.71 70.49,6.35 69.22,6.35 67.31,4.45 65.41,3.17 64.14,2.54 60.33,2.54 55.88,3.17 47.63,6.35 41.28,6.35 35.56,5.71 25.4,5.71 16.51,10.16 14.61,10.79
  pour Bottom (no thermals): 88.9,118.75 89.22,116.52 89.22,111.12 89.85,110.49 90.81,110.49 91.44,111.12 91.44,112.39
  pour Bottom (no thermals): 27.94,95.25 27.31,94.61 27.31,93.98 28.58,93.34 35.56,92.08 36.2,92.08 36.83,92.71 36.83,97.16 34.93,97.16
MA18  (via drill 0.81)
  Top 0.813: v43.82,124.46 46.99,123.83 51.44,122.56 52.71,121.28 55.88,112.39 E12.10
  Bottom 0.813: B.S2 9.53,118.75 20.32,118.75 E11.1 | E11.1 E11.2 | E11.1 30.48,121.92 34.93,123.83 39.37,123.83 v43.82,124.46 | E10.1 72.39,97.16 71.12,99.06 67.31,102.23 66.04,105.41 66.04,107.31 63.5,109.22 60.33,109.86 E12.10
MA19
  Bottom 0.813: E12.5 47.63,107.31 E11.9 E11.10 33.66,110.49 31.12,110.49 29.85,109.22 29.85,107.31 31.12,105.41 31.12,104.14 29.85,102.87 26.67,102.87 25.4,104.14 25.4,106.05 23.5,107.95 19.05,111.12 16.51,112.39 8.89,111.76 B.P2
MA20  (via drill 0.81)
  Top 0.813: v92.08,100.97 94.62,102.23 E14.10 | v55.25,101.6 57.79,102.23 59.69,103.5 61.6,106.05 64.14,110.49 67.31,115.57 E13.1
  Bottom 0.813: B.M2 9.53,105.41 15.88,105.41 20.32,102.87 23.5,100.97 27.31,99.69 51.44,99.69 v55.25,101.6 | E13.1 E13.2 74.93,116.2 E13.10 81.92,109.22 84.46,107.95 87.63,103.19 89.22,101.6 v92.08,100.97
MA21  (via drill 0.81)
  Top 0.813: E5.10 v58.42,42.55
  Bottom 0.813: A.S2 8.89,48.9 20.32,48.9 E4.2 E4.1 27.94,55.88 29.21,57.78 31.12,58.42 33.97,58.42 35.56,58.1 38.74,57.15 46.99,57.15 48.26,56.52 50.48,53.98 51.44,49.53 52.71,45.09 E5.10 | E8.1 97.16,55.24 95.25,55.88 92.08,55.88 85.09,58.42 72.39,58.42 66.68,59.69 64.77,59.69 63.5,59.05 61.6,55.24 58.42,46.35 v58.42,42.55
MA22
  Bottom 0.813: A.P2 8.89,41.91 14.61,41.91 17.78,40.64 19.05,40.01 21.59,36.83 22.86,36.2 28.58,36.2 30.48,37.47 32.39,39.37 E4.9 E4.10 36.83,43.18 45.72,43.18 E5.5 49.53,41.91 52.07,38.73 53.98,36.83 59.06,36.83 64.14,35.56 66.68,35.56 67.95,36.83 67.95,43.81 66.04,50.16 E6.2 E6.1
MA23
  Bottom 0.813: E3.1 E3.2 E2.10 55.88,18.41 54.61,22.86 52.71,26.67 50.8,27.94 44.45,28.89 33.66,28.89 E1.2 E1.1 15.24,29.21 8.89,29.21 A.K2
MA24  (via drill 0.81)
  Top 0.813: v19.05,16.51 v19.05,23.5
  Bottom 0.813: A.H2 8.26,23.5 v19.05,23.5 | v19.05,16.51 20.96,10.16 22.23,8.89 24.13,7.62 26.67,6.99 30.48,6.99 31.75,7.62 34.29,12.06 E1.9 E1.10 E2.5 52.71,13.97 53.34,12.7 54.61,7.62 55.88,5.71 60.33,3.81 64.14,3.81 69.22,7.62 70.49,7.62 72.39,6.99 74.93,6.99 76.2,8.26 77.47,11.43 78.11,13.97 E3.10
MA25
  Bottom 0.813: A.M2 8.89,35.56 14.61,35.56 24.77,33.02 31.75,33.02 36.2,33.66 41.91,35.56 46.99,35.56 53.34,34.29 60.33,33.66 64.14,33.02 67.95,33.02 70.49,35.56 70.49,41.91 E6.10
N$1
  Bottom 0.813: R1.2 23.5,78.11 Q1.2
N$2
  Top 0.813: R5.2 22.86,80.01 21.59,80.01 19.69,81.92 Q2.2
N$3
  Bottom 0.813: R3.2 R4.2 27.31,76.83 Q1.1 19.05,84.45 17.15,87 17.15,90.17 16.51,93.34 14.61,95.89 8.89,95.89 B.J2
N$4
  Bottom 0.813: E8.13 E8.12 104.78,46.99 104.78,40.64 E8.8
N$5  (via drill 0.81)
  Top 0.813: E8.5 97.16,42.55 96.52,36.83 95.89,34.92 93.35,33.02 90.17,33.02 85.73,34.92 83.82,35.56 81.28,35.56 80.01,36.83 80.01,40.01 78.74,41.27 76.2,41.27 74.93,39.37 74.3,37.47 73.03,36.2 71.12,36.2 69.22,38.1 v69.22,47.62
  Bottom 0.813: E5.6 50.8,38.1 53.34,35.56 60.33,34.92 64.14,34.29 66.68,34.29 67.31,34.29 68.58,35.56 69.22,36.2 v69.22,47.62
N$6
  Bottom 0.813: R7.2 R8.2 27.94,91.44 Q2.1 14.61,99.06 8.89,99.06 B.K2
N$7
  Top 0.813: R6.1 E9.6
  Bottom 0.813: R5.1 R6.1
N$8  (via drill 0.81)
  Top 0.813: v62.87,74.3 65.41,74.93 74.93,74.93 83.19,76.83 86.36,77.47 90.17,77.47 93.98,75.56 97.16,73.03 100.97,67.94 102.24,64.14 102.87,61.59 102.87,44.45 E8.9
  Bottom 0.813: E12.8 60.33,106.05 62.87,106.05 64.77,104.14 66.04,101.6 69.85,96.52 70.49,90.17 E10.3 71.12,87.63 69.22,83.82 67.95,82.55 64.77,81.28 62.87,79.38 v62.87,74.3
N$9  (via drill 0.81)
  Top 0.813: E11.11 39.37,115.57 40.64,117.47 41.28,118.75 41.28,125.09 42.55,126.36 43.82,127 46.36,127 v53.34,124.46 | v66.68,125.09 71.12,127 76.2,127 78.11,124.46 v78.11,122.56
  Bottom 0.813: E14.4 E14.5 91.44,109.22 88.9,109.22 87,110.49 85.09,113.67 82.55,120.02 80.65,121.92 v78.11,122.56 | E11.11 39.37,111.76 41.28,111.12 44.45,109.22 46.99,109.22 48.26,110.49 48.26,112.39 E12.3 | v53.34,124.46 56.52,126.36 59.69,126.36 63.5,123.83 64.77,123.83 v66.68,125.09
N$10  (via drill 0.81)
  Top 0.813: E14.2 v87,115.57 | v75.57,124.46 72.39,124.46 67.31,123.19 61.6,123.19 v59.69,123.83 | E11.8 36.83,106.05 38.1,109.86 40.01,113.03 43.18,115.57 45.72,116.84 E12.2
  Bottom 0.813: E14.2 E14.3 | v87,115.57 87,121.28 86.36,121.92 83.19,121.92 79.38,124.46 v75.57,124.46 | E12.2 52.71,119.38 54.61,121.92 57.15,123.83 v59.69,123.83
N$11  (via drill 0.81)
  Top 0.813: v101.6,97.79 99.7,97.16 97.79,95.25 96.52,92.71 93.98,91.44 92.71,90.17 v92.71,85.72
  Bottom 0.813: E14.8 v101.6,97.79 | v92.71,85.72 90.17,82.55 87,78.74 83.82,76.2 79.38,76.2 76.84,79.38 E10.5
N$12  (via drill 0.81)
  Top 0.813: v83.82,101.6 85.73,104.78 88.9,107.31 E14.6
  Bottom 0.813: E10.2 77.47,95.25 80.01,98.42 v83.82,101.6
N$13  (via drill 0.81)
  Top 0.813: E8.10 107.95,45.09 109.22,46.99 109.22,69.85 107.32,73.03 104.78,76.2 101.6,80.64 99.7,83.82 99.06,85.72 98.43,89.53 98.43,92.08 99.06,93.98 100.33,95.25 102.87,95.89 109.86,95.89 111.13,96.52 113.03,98.42 113.03,101.6 111.76,106.05 111.13,109.22 109.22,111.76 106.05,114.94 104.78,116.84 104.14,118.75 104.14,121.92 v105.41,123.19 | v90.81,120.02 87.63,118.75 85.09,117.47 83.82,116.2 83.19,114.3 82.55,109.86 82.55,105.41 81.28,102.87 80.01,102.23 78.11,102.23 76.2,103.5 75.57,105.41 75.57,118.75 74.3,120.65 73.03,121.92 69.22,121.92 v66.68,121.28
  Bottom 0.813: v105.41,123.19 95.89,123.19 93.98,122.56 v90.81,120.02 | E12.6 52.71,109.22 53.98,113.67 54.61,119.38 55.88,121.28 57.15,121.92 65.41,121.92 v66.68,121.28
N$14  (via drill 0.81)
  Top 0.813: v41.91,104.78 39.37,102.87 36.2,100.97 33.02,100.97 31.12,102.87 E11.6
  Bottom 0.813: E12.13 57.15,116.84 55.88,114.3 53.98,105.09 50.8,102.87 45.09,102.87 v41.91,104.78
N$15  (via drill 0.81)
  Top 0.813: E12.1 v43.82,120.65
  Bottom 0.813: v43.82,120.65 40.01,121.92 34.29,121.92 32.39,120.65 E11.3
N$16  (via drill 0.81)
  Top 0.813: E14.1 91.44,121.92 88.27,123.19 v81.92,125.09
  Bottom 0.813: v81.92,125.09 78.74,127 74.93,127 72.39,125.73 71.12,124.46 70.49,122.56 70.49,116.84 E13.3
N$17
  Bottom 0.813: E13.6 74.3,106.68 76.84,104.78 78.74,102.87 81.28,102.87 82.55,103.5 83.82,103.5 85.09,102.23 87,99.69 88.9,97.79 92.08,93.98 93.98,92.71 99.7,90.81 102.87,90.81 104.14,92.08 104.78,93.34 104.78,114.3 E14.13
N$18
  Bottom 0.813: E4.11 45.09,48.9 E5.3
N$19  (via drill 0.81)
  Top 0.813: v95.25,94.61 90.81,92.08 v85.09,84.45
  Bottom 0.813: E10.9 83.19,82.55 v85.09,84.45 | E13.11 81.28,112.39 83.82,111.12 85.73,109.22 87.63,105.41 89.54,103.19 90.17,102.87 93.35,102.87 94.62,102.23 96.52,98.42 96.52,96.52 v95.25,94.61
N$20
  Bottom 0.813: E8.3 E7.11 E7.1
N$21
  Top 0.813: E13.8 78.11,106.68 78.11,113.03 E13.12
  Bottom 0.813: E13.12 E13.13
N$22  (via drill 0.81)
  Top 0.813: E4.8 36.83,39.37 38.1,41.91 v39.37,49.53
  Bottom 0.813: E5.2 43.18,50.16 v39.37,49.53
N$23
  Bottom 0.813: E1.3 31.12,23.5 32.39,26.04 34.61,27.62 44.13,27.62 E2.1
N$24
  Top 0.813: E2.8 63.5,10.79 64.77,11.43 66.68,13.97 67.95,18.41 69.22,24.13 69.85,26.67 71.12,27.94 73.66,27.94 75.57,26.67 E3.13
  Bottom 0.813: E3.13 78.11,24.77 76.52,27.3 76.52,46.99 74.93,49.53 E6.13
N$25  (via drill 0.81)
  Top 0.813: v62.87,8.26 57.79,8.26 E2.6 | v67.31,27.3 v62.87,13.34
  Bottom 0.813: E6.12 74.3,46.99 75.25,45.09 75.25,34.92 74.3,33.02 69.85,28.57 v67.31,27.3 | v62.87,8.26 v62.87,13.34
N$26  (via drill 0.81)
  Top 0.813: v22.86,19.68 22.86,21.59 23.5,24.77 24.77,27.3 26.67,28.57 31.75,30.48 37.47,33.02 40.01,33.02 41.28,31.75 41.28,30.48 40.01,26.67 40.01,24.13 41.28,22.86 43.18,22.86 49.53,29.21 52.71,29.21 E2.13
  Bottom 0.813: E1.6 26.04,14.61 v22.86,19.68
N$27
  Bottom 0.813: E1.11 E2.3
N$28  (via drill 0.81)
  Top 0.813: E2.2 48.26,22.23 45.72,19.05 v41.91,12.7
  Bottom 0.813: E1.8 v41.91,12.7
N$30
  Bottom 0.813: E8.4 100.97,46.99 102.24,48.9 102.24,53.34 100.97,55.88 99.7,57.15 97.79,57.78 92.08,57.78 83.82,60.33 79.38,59.69 74.93,59.69 70.49,60.96 68.58,61.59 66.04,61.59 64.14,60.96 62.23,59.69 60.96,57.15 57.79,49.53 56.52,44.45 56.52,41.27 E5.8 59.69,40.64 61.6,40.64 62.87,39.37 62.87,38.1 64.14,36.83 66.04,36.83 66.68,37.47 66.68,41.91 E6.5
N$38
  Bottom 0.813: E4.3 29.85,49.53 31.12,50.8 32.39,53.98 34.29,55.56 35.56,55.56 37.47,54.61 38.74,52.07 40.01,51.44 42.55,51.44 E5.1
N$39  (via drill 0.81)
  Top 0.813: v27.94,59.05 26.04,57.15 25.4,55.88 25.4,43.81 E4.6
  Bottom 0.813: E5.13 53.34,51.44 50.8,55.88 48.9,57.78 46.36,59.05 44.45,59.05 41.91,58.42 38.74,58.42 34.61,59.69 29.85,59.69 v27.94,59.05
PR18  (via drill 0.81)
  Top 0.813: E10.13 73.03,95.25 71.12,95.25 69.22,93.98 67.95,92.08 v67.95,90.17 | E11.5 v31.75,108.58
  Bottom 0.813: B.R2 9.53,115.57 20.32,115.57 24.13,114.3 E11.4 E11.5 | E12.9 55.88,104.78 | 55.88,104.78 57.79,102.87 59.06,102.87 60.96,104.78 62.23,104.78 63.5,103.5 66.04,98.42 67.95,95.25 v67.95,90.17 | 55.88,104.78 52.71,102.23 50.8,101.6 36.2,101.6 34.93,102.23 33.02,104.14 v31.75,108.58
PR19  (via drill 0.81)
  Top 0.813: E12.4 47.63,113.03 43.82,113.03 41.28,110.49 38.1,104.14 36.83,102.87 35.56,102.23 34.93,102.23 33.66,103.5 33.66,113.03 E11.12 | v19.69,107.31 24.13,107.31 25.4,108.58 25.4,121.28 26.67,122.56 28.58,122.56 E11.13
  Bottom 0.813: B.N2 9.53,108.58 15.88,108.58 v19.69,107.31 | E11.13 E11.12
PR20  (via drill 0.81)
  Top 0.813: v61.6,102.23 65.41,106.68 69.22,108.58 E13.4 | v93.98,98.42 97.79,103.5 E14.9
  Bottom 0.813: B.L2 8.89,102.23 15.88,102.23 24.77,98.42 56.52,98.42 58.42,99.06 60.33,100.33 v61.6,102.23 | E13.4 E13.5 E13.9 82.55,106.68 84.46,104.78 88.9,100.01 91.44,98.42 v93.98,98.42
PR21  (via drill 0.81)
  Top 0.813: E8.2 100.97,53.34 100.97,57.15 100.33,61.59 99.7,64.77 98.43,67.31 96.52,69.85 92.08,74.3 89.54,75.56 84.46,75.56 77.47,73.66 76.2,73.66 71.76,73.03 64.77,72.39 58.42,72.39 55.25,73.66 53.34,74.3 48.26,74.3 46.99,73.66 45.72,72.39 44.45,66.04 43.18,64.77 41.28,64.14 40.01,64.14 37.47,65.41 35.56,65.41 34.29,64.77 33.02,62.87 v30.48,55.24 30.48,49.53 E4.4
  Bottom 0.813: A.R2 8.26,45.72 17.78,45.72 21.59,46.99 25.4,46.99 E4.4 E4.5 | E5.9 52.07,43.18 50.8,46.35 48.9,53.98 47.63,55.24 46.67,55.88 38.74,55.88 35.56,56.83 33.66,56.83 v30.48,55.24
PR22  (via drill 0.81)
  Top 0.813: E4.12 33.66,46.99 v33.66,36.2 35.56,36.2 36.83,36.83 38.74,38.73 40.64,41.27 41.91,42.55 E5.4 53.34,36.83 55.88,36.83 58.42,40.01 60.96,41.91 E6.4
  Bottom 0.813: A.N2 8.89,38.73 14.61,38.73 17.15,38.1 20.32,36.2 22.23,34.92 30.48,34.92 v33.66,36.2 | E4.12 E4.13
PR23
  Top 0.813: E1.5 34.29,8.89 37.47,8.89 38.74,10.16 39.37,13.97 40.64,16.51 46.36,23.5 49.53,27.3 50.17,27.94 51.44,27.94 53.98,24.77 55.88,17.14 56.52,15.24 E2.9
  Bottom 0.813: E2.9 66.68,17.78 E3.4 E3.3 | A.J2 8.89,26.67 14.61,26.67 20.32,25.4 22.86,24.13 25.4,20.32 E1.4 E1.5
PR24  (via drill 0.81)
  Top 0.813: E1.12 E1.13 37.47,24.77 38.74,27.3 v38.74,31.11
  Bottom 0.813: E3.12 E3.11 | A.F2 8.89,20.32 17.78,20.32 20.32,19.05 21.59,17.78 22.23,15.88 22.23,11.43 22.86,10.16 24.77,8.89 26.67,8.26 28.58,8.26 29.85,8.89 31.12,10.16 31.75,12.06 32.39,16.51 33.66,19.68 E1.12 E1.13 | E3.11 76.84,15.88 75.57,13.97 75.57,10.16 74.3,8.89 67.31,8.89 64.14,5.71 61.6,5.71 59.06,6.99 57.15,8.26 53.98,15.24 E2.4 | v38.74,31.11 41.28,30.48 42.86,30.16 51.75,30.16 57.79,28.57 61.6,27.94 64.14,26.04 66.04,24.77 67.95,24.77 71.76,27.94 73.66,27.94 75.88,26.04 77.47,21.59 E3.11
PR25
  Bottom 0.813: A.L2 10.16,32.38 18.42,32.38 24.77,31.11 31.75,31.11 36.83,32.38 42.55,34.29 46.36,34.29 50.8,32.38 59.69,29.84 65.41,29.84 71.12,33.02 73.66,35.56 73.98,38.1 73.98,39.37 E6.9
TP1  (via drill 0.81)
  Top 0.813: v87.63,73.66 87.63,69.22 | 87.63,69.22 85.09,69.22 85.09,63.5 86.36,63.5 | 86.36,63.5 90.81,63.5 90.81,69.22 87.63,69.22 | E7.8 86.36,41.91 86.36,63.5
  Bottom 0.813: E10.6 74.61,79.69 77.47,75.56 78.74,74.3 80.65,73.66 v87.63,73.66
  pour Top: 90.81,69.22 85.09,69.22 85.09,63.5 90.81,63.5
TP2  (via drill 0.81)
  Top 0.813: v95.25,13.34 97.79,12.06 | 97.79,12.06 97.79,6.99 104.14,6.99 104.14,13.34 97.79,13.34 97.79,12.06 | E7.13 91.44,48.9 92.08,46.35 v92.08,34.92
  Bottom 0.813: E3.8 v95.25,13.34 v92.08,34.92
  pour Top: 97.79,13.34 97.79,6.99 104.14,6.99 104.14,13.34
TP3  (via drill 0.81)
  Top 0.813: v83.82,56.52 82.55,59.69 80.65,62.87 78.11,64.77 | 78.11,64.77 78.11,63.5 73.66,63.5 | 73.66,63.5 72.39,63.5 72.39,69.85 78.11,69.85 78.11,64.77 | 73.66,63.5 73.66,60.96 74.3,59.69 76.2,58.42 78.42,55.88 78.42,55.24 78.11,52.07 76.2,48.26 75.57,45.72 74.93,42.55 74.3,40.64 E6.8
  Bottom 0.813: E7.12 86.36,52.07 v83.82,56.52
  pour Top: 72.39,69.85 72.39,63.5 78.11,63.5 78.11,69.85
TP4  (via drill 0.81)
  Top 0.813: v75.57,52.07 73.03,57.15 71.12,62.23 71.12,67.31 70.49,68.58 69.22,69.22 65.41,69.22 | 65.41,69.22 65.41,63.5 59.69,63.5 59.69,69.85 65.41,69.85 65.41,69.22
  Bottom 0.813: v75.57,52.07 E7.3 E7.4 83.82,44.45 87,38.73 88.9,36.83 90.81,36.83 92.08,38.1 93.35,40.64 94.62,41.91 98.43,41.91 E8.6
  pour Top: 59.69,69.85 59.69,63.5 65.41,63.5 65.41,69.85
TP5  (via drill 0.81)
  Top 0.813: v64.77,57.15 62.23,59.69 59.69,61.59 57.79,63.5 57.79,67.31 57.15,68.58 56.52,69.22 52.71,69.22 | 52.71,69.22 52.71,69.85 46.99,69.85 46.99,63.5 52.71,63.5 52.71,69.22
  Bottom 0.813: E7.10 E7.2 80.65,52.7 79.38,55.88 77.47,57.15 v64.77,57.15 62.87,54.61 62.87,43.18 E6.6
  pour Top: 46.99,69.85 46.99,63.5 52.71,63.5 52.71,69.85
TP6  (via drill 0.81)
  Top 0.813: v104.14,26.04 102.24,22.86 | 102.24,22.86 97.79,22.86 97.79,17.14 103.51,17.14 103.51,22.86 102.24,22.86 | E10.10 84.46,81.92 94.62,81.28 97.79,80.01 101.6,76.2 103.51,71.75 104.14,61.59 104.14,48.26 E8.11
  Bottom 0.813: E8.11 108.59,45.09 109.22,43.18 109.22,36.83 v104.14,26.04 | E10.4 E10.10
  pour Top: 97.79,22.86 103.51,22.86 103.51,17.14 97.79,17.14
VCC  (via drill 0.81)
  Top 0.813: C6.1 83.19,27.94 | 83.19,27.94 78.11,29.21 66.68,29.21 C4.1 | v108.59,28.57 83.19,27.94 | v54.61,66.67 E5.14 C10.1 | v69.22,66.67 69.22,61.59 70.49,57.15 E6.14 | C18.1 68.58,95.89 70.49,96.52 74.3,96.52 E10.14 | v36.2,63.5 E4.14 C8.1 | E7.14 89.54,60.33 92.71,63.5 v93.98,66.67 | E8.14 v106.68,66.67 | E12.14 56.52,123.83 56.52,130.18 | 56.52,130.18 80.01,130.18 | 80.01,130.18 88.27,128.27 93.98,125.73 E14.14 | 80.01,130.18 E13.14 C26.1 | v19.69,126.36 26.67,126.36 E11.14 35.56,125.73 36.83,128.27 40.01,130.18 56.52,130.18 | C2.1 48.9,31.11 53.34,31.11 E2.14
  Bottom 0.813: E3.14 C6.1 | A.V2 9.53,57.78 19.69,57.78 27.31,63.5 v36.2,63.5 40.64,63.5 50.17,66.67 v54.61,66.67 v69.22,66.67 v93.98,66.67 v106.68,66.67 107.32,67.31 107.32,85.72 | E6.14 C12.1 | E7.14 C14.1 | E2.14 C4.1 | E1.14 C2.1 | v108.59,28.57 111.76,35.56 C16.1 E8.14 | E9.14 C18.1 | E10.14 C20.1 C31.+ C30.1 107.32,85.72 | B.V2 8.89,128.27 14.61,128.27 v19.69,126.36 | E11.14 C22.1 | E12.14 C24.1 | 107.32,85.72 C28.1 E14.14 | E5.14 C10.1
  pour Top (no thermals): 19.05,127 19.05,126.36 19.69,125.73 26.67,125.73 35.56,119.38 36.2,120.02 36.2,127 38.74,128.91 54.61,128.91 56.52,122.56 58.42,119.38 59.06,120.02 57.15,123.19 57.15,128.27 57.79,128.91 77.47,128.91 79.38,125.73 79.38,119.38 85.09,119.38 85.73,120.02 85.09,120.65 80.01,120.65 80.01,127.64 80.65,128.27 85.73,128.27 89.54,127 93.35,125.09 100.97,119.38 102.24,119.38 102.24,120.65 95.89,125.09 90.81,128.27 86.36,129.54 80.65,130.81 40.01,130.81 36.2,128.27 32.39,123.19 29.21,125.73 24.77,127.64 19.69,127.64
  pour Top (no thermals): 82.55,24.13 83.82,24.13 85.73,26.04 87.63,27.3 94.62,27.94 108.59,27.94 109.22,28.57 108.59,29.21 95.25,28.57 83.19,28.57 78.74,29.84 66.04,29.84 57.79,29.21 53.34,31.11 52.71,31.11 55.88,28.57 58.42,25.4 61.6,24.77 66.68,28.57 69.22,29.21 76.84,29.21 81.28,27.3 81.92,24.77
  pour Top (no thermals): 35.56,63.5 34.93,57.78 34.93,53.98 35.56,53.34 40.64,53.34 41.28,53.98 41.28,54.61 39.37,55.88 38.1,58.42 37.47,62.23 37.47,63.5 36.83,64.14 36.2,64.14
  pour Top (no thermals): 54.61,67.31 53.98,66.67 53.98,53.98 54.61,53.34 55.25,53.98 54.93,56.83 54.93,61.59 55.25,66.67
  pour Top (no thermals): 69.22,67.31 68.58,67.31 67.95,66.67 68.58,62.23 69.85,57.78 71.76,53.34 72.39,53.34 73.03,53.98 70.49,59.69 69.85,62.87 69.85,66.67
  pour Top (no thermals): 92.08,62.87 92.71,66.67 93.35,67.31 93.98,67.31 94.62,66.67 94.62,66.04 93.35,64.14
  pour Top (no thermals): 88.27,53.98 88.9,53.34 92.71,53.34 93.35,53.98 93.35,54.61 91.44,56.52 90.81,57.15 90.81,61.59 88.27,59.05
  pour Top (no thermals): 106.05,67.31 106.68,67.31 107.32,66.67 107.32,59.05 107.95,54.61 107.95,53.98 107.32,53.34 106.05,53.34 105.41,53.98 105.41,66.67
  pour Bottom (no thermals): 106.68,53.34 105.41,53.98 106.68,54.61 112.4,54.61 113.03,53.98 112.71,50.16 112.71,43.81 111.76,34.29 109.22,27.94 108.59,27.94 107.95,28.57 110.49,34.29 110.81,36.83 110.81,52.07 109.86,52.7
  pour Bottom (no thermals): 100.97,120.02 101.6,119.38 106.05,119.38 106.68,118.75 106.05,93.98 106.05,87.63 105.41,87 104.14,87 95.25,90.81 90.17,91.44 84.46,91.76 80.65,93.98 79.38,93.98 79.38,92.71 80.65,92.71 83.82,90.17 94.62,88.9 98.43,87 103.51,85.09 106.68,83.82 106.68,80.01 106.05,76.2 106.05,68.58 104.78,67.31 50.8,67.31 46.99,66.67 39.37,64.14 27.31,64.14 24.13,62.23 20.32,58.42 13.97,58.42 13.97,57.78 15.24,57.15 19.69,57.15 21.59,58.42 25.08,61.91 27.94,62.87 31.75,62.87 34.93,62.55 38.42,62.55 41.28,62.87 45.09,64.14 50.17,65.41 107.32,65.41 107.95,66.04 107.95,93.98 108.59,120.65 107.95,121.28 101.6,121.28 100.97,120.65
  pour Bottom (no thermals): 13.97,127.64 13.97,128.27 14.61,128.27 19.05,127 20.32,127 20.96,126.36 20.32,125.73 19.05,125.73
  pour Bottom (no thermals): 57.79,93.34 58.42,93.98 65.41,93.98 66.04,93.34 65.41,92.71 58.42,92.71

### Text on the board
Top: TP5 | TP3 | TP1 | TP4 | TP6 | TP2
Bottom: PROTECTION COMPARATOR | B168A